# Altium schematic sheet FIT_HDMI_X19-9.SchDoc: FIT_PM12 board
size 420 x 297 mm; CheckedBy: G.Kasprowicz; Author: INR Moscow; CompanyName: WUT ISE; DrawnBy: M.Podgórski; Organization: WUT ISE; Address1: PW ISE; Address2: Nowowiejska 15/19 00-665 Warsaw; Address3: gkasprow@gmail.com; Revision: 2; SheetNumber: -; SheetTotal: -; ModifiedBy: -; CheckedDate: -; Title2: Title 2; DivGrp: WUT ISE; Designer: INR RAS; ModifiedDate: -; ProjectName: Sensor Box
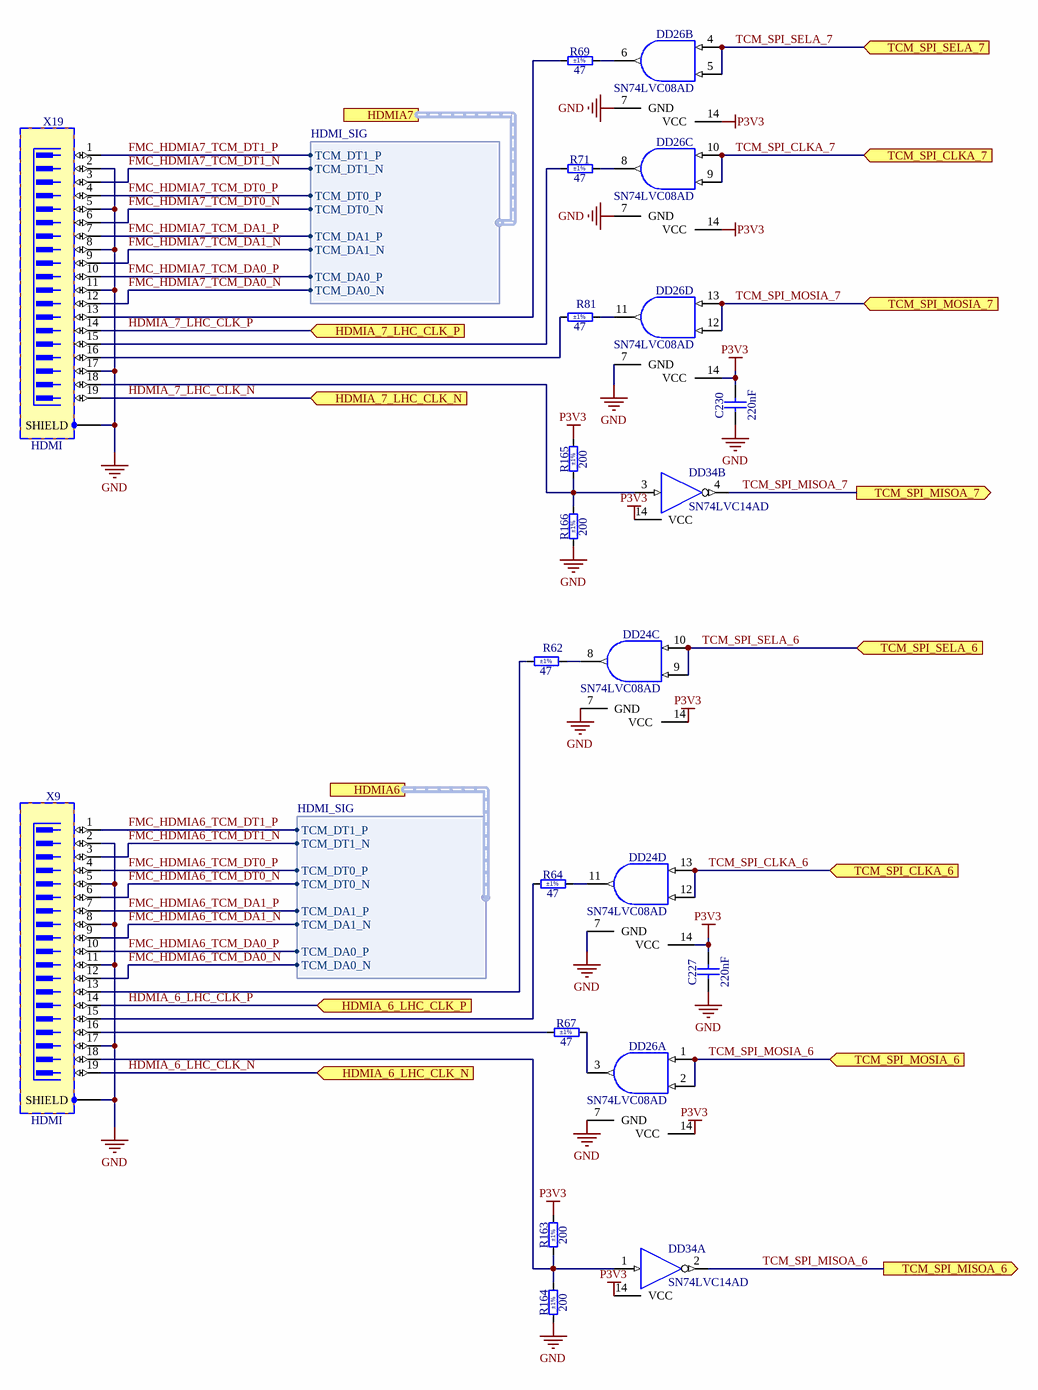
[diagram p0: FIT_HDMI_X19-9.SchDoc]

## Parts
C227  220nF  [CAPC2012X135N]
C230  220nF  [CAPC2012X135N]
DD24  SN74LVC08AD  [SOIC127P600X175-14N]  (parts C,D of 4)
DD26  SN74LVC08AD  [SOIC127P600X175-14N]  (parts A,B,C,D of 4)
DD34  SN74LVC14AD  [SOIC127P600X175-14N]  (parts A,B of 6)
R62  47  Tolerance: ±1%  [RESC2012X60N]
R64  47  Tolerance: ±1%  [RESC2012X60N]
R67  47  Tolerance: ±1%  [RESC2012X60N]
R69  47  Tolerance: ±1%  [RESC2012X60N]
R71  47  Tolerance: ±1%  [RESC2012X60N]
R81  47  Tolerance: ±1%  [RESC2012X60N]
R163  200  Tolerance: ±1%  [RESC2012X60N]
R164  200  Tolerance: ±1%  [RESC2012X60N]
R165  200  Tolerance: ±1%  [RESC2012X60N]
R166  200  Tolerance: ±1%  [RESC2012X60N]
X9  HDMI  [TYCO_2007435-1]
X19  HDMI  [TYCO_2007435-1]

## Ports
HDMIA6 (harness HDMI_SIG), HDMIA7 (harness HDMI_SIG), HDMIA_6_LHC_CLK_N (in), HDMIA_6_LHC_CLK_P (in), HDMIA_7_LHC_CLK_N (in), HDMIA_7_LHC_CLK_P (in), TCM_SPI_CLKA_6 (in), TCM_SPI_CLKA_7 (in), TCM_SPI_MISOA_6 (out), TCM_SPI_MISOA_7 (out), TCM_SPI_MOSIA_6 (in), TCM_SPI_MOSIA_7 (in), TCM_SPI_SELA_6 (in), TCM_SPI_SELA_7 (in)

## Harnesses
HDMI_SIG: TCM_DT1_P, TCM_DT1_N, TCM_DT0_P, TCM_DT0_N, TCM_DA1_P, TCM_DA1_N, TCM_DA0_P, TCM_DA0_N

## Nets
GND: C227.1 C230.1 DD24.7(GND) DD26.7(GND) DD34.7(GND) R164.1 R166.1 X9.2 X9.5 X9.8 X9.11 X9.17 X9.SHIELD X19.2 X19.5 X19.8 X19.11 X19.17 X19.SHIELD
P3V3: C227.2 C230.2 DD24.14(VCC) DD26.14(VCC) DD34.14(VCC) R163.2 R165.2  [also labelled VCC]
FMC_HDMIA6_TCM_DA0_N: X9.12 ; port HDMIA6.TCM_DA0_N
FMC_HDMIA6_TCM_DA0_P: X9.10 ; port HDMIA6.TCM_DA0_P
FMC_HDMIA6_TCM_DA1_N: X9.9 ; port HDMIA6.TCM_DA1_N
FMC_HDMIA6_TCM_DA1_P: X9.7 ; port HDMIA6.TCM_DA1_P
FMC_HDMIA6_TCM_DT0_N: X9.6 ; port HDMIA6.TCM_DT0_N
FMC_HDMIA6_TCM_DT0_P: X9.4 ; port HDMIA6.TCM_DT0_P
FMC_HDMIA6_TCM_DT1_N: X9.3 ; port HDMIA6.TCM_DT1_N
FMC_HDMIA6_TCM_DT1_P: X9.1 ; port HDMIA6.TCM_DT1_P
FMC_HDMIA7_TCM_DA0_N: X19.12 ; port HDMIA7.TCM_DA0_N
FMC_HDMIA7_TCM_DA0_P: X19.10 ; port HDMIA7.TCM_DA0_P
FMC_HDMIA7_TCM_DA1_N: X19.9 ; port HDMIA7.TCM_DA1_N
FMC_HDMIA7_TCM_DA1_P: X19.7 ; port HDMIA7.TCM_DA1_P
FMC_HDMIA7_TCM_DT0_N: X19.6 ; port HDMIA7.TCM_DT0_N
FMC_HDMIA7_TCM_DT0_P: X19.4 ; port HDMIA7.TCM_DT0_P
FMC_HDMIA7_TCM_DT1_N: X19.3 ; port HDMIA7.TCM_DT1_N
FMC_HDMIA7_TCM_DT1_P: X19.1 ; port HDMIA7.TCM_DT1_P
HDMIA_6_LHC_CLK_N: X9.19 ; port HDMIA_6_LHC_CLK_N
HDMIA_6_LHC_CLK_P: X9.14 ; port HDMIA_6_LHC_CLK_P
HDMIA_7_LHC_CLK_N: X19.19 ; port HDMIA_7_LHC_CLK_N
HDMIA_7_LHC_CLK_P: X19.14 ; port HDMIA_7_LHC_CLK_P
TCM_SPI_CLKA_6: DD24.12(B) DD24.13(A) ; port TCM_SPI_CLKA_6
TCM_SPI_CLKA_7: DD26.9(B) DD26.10(A) ; port TCM_SPI_CLKA_7
TCM_SPI_MISOA_6: DD34.2(OUT) ; port TCM_SPI_MISOA_6
TCM_SPI_MISOA_7: DD34.4(OUT) ; port TCM_SPI_MISOA_7
TCM_SPI_MOSIA_6: DD26.1(A) DD26.2(B) ; port TCM_SPI_MOSIA_6
TCM_SPI_MOSIA_7: DD26.12(B) DD26.13(A) ; port TCM_SPI_MOSIA_7
TCM_SPI_SELA_6: DD24.9(B) DD24.10(A) ; port TCM_SPI_SELA_6
TCM_SPI_SELA_7: DD26.4(A) DD26.5(B) ; port TCM_SPI_SELA_7
NetDD24_8: DD24.8(Y) R62.2
NetDD24_11: DD24.11(Y) R64.2
NetDD26_3: DD26.3(Y) R67.2
NetDD26_6: DD26.6(Y) R69.2
NetDD26_8: DD26.8(Y) R71.2
NetDD26_11: DD26.11(Y) R81.2
NetDD34_1: DD34.1(IN) R163.1 R164.2 X9.18
NetDD34_3: DD34.3(IN) R165.1 R166.2 X19.18
NetR62_1: R62.1 X9.13
NetR64_1: R64.1 X9.15
NetR67_1: R67.1 X9.16
NetR69_1: R69.1 X19.13
NetR71_1: R71.1 X19.15
NetR81_1: R81.1 X19.16

## Notes on the sheet
- Project/Equipment
- Document
- Designer
- Drawn by
- Check.by
- Copyright WUT ISE 2024.
  This documentation describes Open Hardware and is licensed under the CERN OHL v.2. You may redistribute and modify this documentation under the terms of the CERN OHL v.2. (http://ohwr.org/CERNOHL). This documentation is distributed WITHOUT ANY EXPRESS OR IMPLIED WARRANTY, INCLUDING OF MERCHANTABILITY, SATISFACTORY QUALITY AND FITNESS FOR A PARTICULAR PURPOSE. Please see the CERN OHL v.2 for applicable conditions.
- Contact
- File
- Last Mod.
- Print Date
- Sheet
- Size
- A3
- of
- Rev

## Library data of the parts
C227 C230 = CC0805_220NF_50V_10%_X7R: Non-polarised capacitor; Part Description: SMD Multilayer Chip Ceramic Capacitor; Manufacturer: GENERIC; Manufacturer1 Part Number: GRM21BR71H224KA01L; Voltage: 50V; TC: X7R; Tolerance: ±10%; Part Number: CC0805_220NF_50V_10%_X7R; Component Kind: Standard; Component Type: Standard; Pin Count: 2; Value: 220nF; Status: Preferred; Manufacturer Part Number: CC0805_220NF_50V_10%_X7R; Case: 0805; Mounted: Yes; Socket: No; SMD: Yes; Sense: No; Manufacturer1 Example: MURATA; Manufacturer1 ComponentHeight: 1.35mm; HelpURL: \\cern.ch\dfs\Applications\Altium\Datasheets\CC0805_X7R_MURATA.pdf; Author: CERN DEM JLC; CreateDate: 03.12.2007; LatestRevisionDate: 03.12.2007
DD24 DD26 = SN74LVC08AD: Quad 2-Input AND Gate; Part Description: Quadruple 2-Input Positive-AND Gate; Manufacturer: TEXAS INSTRUMENTS; PressFit: No; Bonding: No; Part Number: SN74LVC08AD; Component Kind: Standard; Component Type: Standard; Device: SN74LVC08AD; PackageDescription: SOIC 14, Pitch 1.27mm - Body 4x8.75mm, IPC Medium Density; Manufacturer Part Number: SN74LVC08AD; Pin Count: 14; Case: SOIC14; Mounted: Yes; Socket: No; SMD: Yes; Sense: No; ComponentHeight: 1.75mm; Author: CERN DEM JLC; HelpURL: \\cern.ch\dfs\Applications\Altium\Datasheets\SN74LVC08AD.pdf; CreateDate: 21.03.2012; LatestRevisionDate: 21.03.2012
DD34 = SN74LVC14AD: Hex Schmitt-Trigger Inverter; Manufacturer: TEXAS INSTRUMENTS; PressFit: No; Bonding: No; Part Number: SN74LVC14AD; Component Kind: Standard; Component Type: Standard; Device: SN74LVC14AD; PackageDescription: SOIC 14, Pitch 1.27mm - Body 4x8.75mm, IPC Medium Density; Part Description: Hex Schmitt-Trigger Inverter; Manufacturer Part Number: SN74LVC14AD; Pin Count: 14; Case: SOIC14; Mounted: Yes; Socket: No; SMD: Yes; Sense: No; ComponentHeight: 1.75mm; Author: CERN DEM JMW; HelpURL: \\cern.ch\dfs\Applications\Altium\Datasheets\SN74LVC14AD.pdf; CreateDate: 29.09.2008; LatestRevisionDate: 29.09.2008
R62 R64 R67 R69 R71 R81 = R0805_47R_1%_0.125W_100PPM: Resistor - 1%; Part Description: General Purpose Thick Film Chip Resistor; Manufacturer: GENERIC; Manufacturer1 Part Number: NRC10F47R0TRF; Power: 0.125W; TC: ±100ppm/°C; PressFit: No; Part Number: R0805_47R_1%_0.125W_100PPM; Component Kind: Standard; Component Type: Standard; Pin Count: 2; Value: 47; Status: Preferred; Manufacturer Part Number: R0805_47R_1%_0.125W_100PPM; Case: 0805; Mounted: Yes; Sense: No; Socket: No; SMD: Yes; Manufacturer1 Example: NIC COMPONENT; Manufacturer1 ComponentHeight: 0.6mm; HelpURL: \\cern.ch\dfs\Applications\Altium\Datasheets\R0805_NIC_NRC.pdf; Author: CERN DEM JLC; CreateDate: 03.12.2007; LatestRevisionDate: 13.03.2008
R163-R166 = R0805_200R_1%_0.125W_100PPM: Resistor - 1%; Part Description: General Purpose Thick Film Chip Resistor; Manufacturer: GENERIC; Manufacturer1 Part Number: NRC10F2000TRF; Power: 0.125W; TC: ±100ppm/°C; PressFit: No; Part Number: R0805_200R_1%_0.125W_100PPM; Component Kind: Standard; Component Type: Standard; Pin Count: 2; Value: 200; Status: Preferred; Manufacturer Part Number: R0805_200R_1%_0.125W_100PPM; Case: 0805; Mounted: Yes; Sense: No; Socket: No; SMD: Yes; Manufacturer1 Example: NIC COMPONENT; Manufacturer1 ComponentHeight: 0.6mm; HelpURL: \\cern.ch\dfs\Applications\Altium\Datasheets\R0805_NIC_NRC.pdf; Author: CERN DEM JLC; CreateDate: 03.12.2007; LatestRevisionDate: 13.03.2008
X9 X19 = TYCO_2007435-1: Connector HDMI 19 Male + 1 Shield; Part Description: 0.578mm Pitch, Through-Hole Right Angle 19 Contacts Flag-HDMI Type-A Receptacle Thru Hole Mounting Pads; Manufacturer: TYCO ELECTRONICS; PressFit: No; Part Number: TYCO_2007435-1; Component Kind: Standard; Component Type: Standard; Pin Count: 23; Family: HDMI; Mounted: Yes; Socket: No; SMD: No; Sense: No; Status: None; Manufacturer Part Number: 2007435-1; ComponentHeight: 16.4mm; HelpURL: \\cern.ch\dfs\Applications\Altium\Datasheets\TYCO_2007435-1.pdf; Author: CERN DEM MR; CreateDate: 05.07.2016; LatestRevisionDate: 05.07.2016